# Altium schematic sheet eeprom.SchDoc
size A4; SheetNumber: 5; SheetTotal: 6
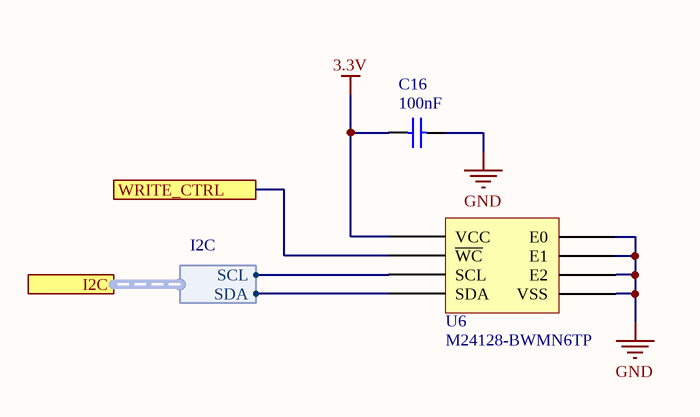
[diagram p0: eeprom.SchDoc]

## Parts
C16  value 100nF  [0603 - Capacitor]  (hidden comment: Capacitor - Nonpolarized)
U6  (no value)  [SOIC127P600X175-8N]

## Ports
I2C (harness I2C), WRITE_CTRL

## Harnesses
I2C: SDA, SCL

## Nets
3.3V: C16.1 U6.8(VCC)
GND: C16.2 U6.1(E0) U6.2(E1) U6.3(E2) U6.4(VSS)
WRITE_CTRL: U6.7(~{WC}) ; port WRITE_CTRL
NetU6_5: U6.5(SDA) ; port I2C.SDA
NetU6_6: U6.6(SCL) ; port I2C.SCL

## Library data of the parts
C16 = Capacitor - Nonpolarized: Nonpolarized Capacitor; Supplier Part Number: *; Supplier: *; Manufacturer: *; Rating: *; Manufacturer Part Number: *
U6 = M24128-BWMN6TP: EEPROM Memory IC 128Kb (16K x 8) I²C 1 MHz 450 ns 8-SOIC; Manufacturer_Name: STMicroelectronics; Datasheet Link: http://www.st.com/st-web-ui/static/active/en/resource/technical/document/datasheet/CD00259167.pdf; Height: 1.75mm; Supplier: Digi-Key; Supplier Part Number: 497-8621-2-ND; ComponentLink1Description: Datasheet; ComponentLink1URL: https://www.st.com/content/ccc/resource/technical/document/datasheet/59/05/c9/5b/7b/41/48/b6/CD00259167.pdf/files/CD00259167.pdf/jcr:content/translations/en.CD00259167.pdf; Manufacturer_Part_Number: M24128-BWMN6TP